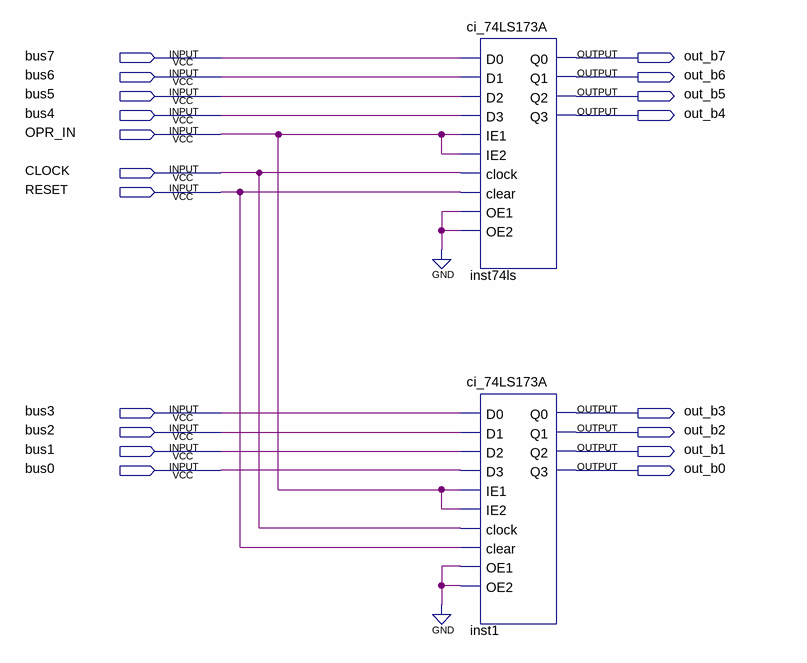
[diagram p0: schematic sheet]
// Quartus schematic output_register.bdf as structural Verilog: 2 symbols, 19 pins
module output_register (
  input  bus7,
  input  bus6,
  input  bus5,
  input  bus4,
  input  OPR_IN,
  input  CLOCK,
  input  RESET,
  input  bus3,
  input  bus2,
  input  bus1,
  input  bus0,
  output out_b7,
  output out_b6,
  output out_b5,
  output out_b4,
  output out_b3,
  output out_b2,
  output out_b1,
  output out_b0
);

  ci_74LS173A inst74ls (
    .D0(bus7), .D1(bus6), .D2(bus5), .D3(bus4), .IE1(OPR_IN), .IE2(OPR_IN), .clock(CLOCK), .clear(RESET),
    .OE1(1'b0), .OE2(1'b0), .Q0(out_b7), .Q1(out_b6), .Q2(out_b5), .Q3(out_b4));
  ci_74LS173A inst1 (
    .D0(bus3), .D1(bus2), .D2(bus1), .D3(bus0), .IE1(OPR_IN), .IE2(OPR_IN), .clock(CLOCK), .clear(RESET),
    .OE1(1'b0), .OE2(1'b0), .Q0(out_b3), .Q1(out_b2), .Q2(out_b1), .Q3(out_b0));
endmodule
